# EAGLE design Adafruit PiRTC PCF8523 (EAGLE 6.4)
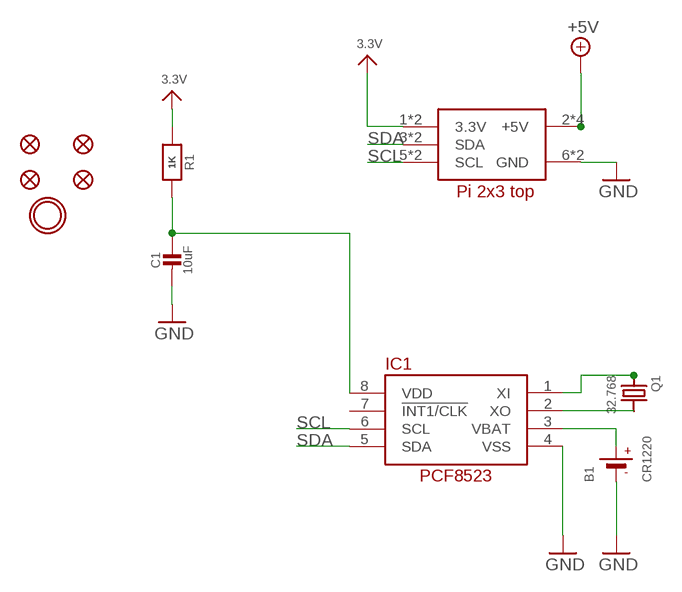
[diagram p0: schematic, sheet 1]

## Parts
B1  CR1220  BATTERYCR1220_SMT  [CR1220]
C1  10uF  CAP_CERAMIC0805-NOOUTLINE  [0805-NO]
FID1  FIDUCIAL_1MM  [FIDUCIAL_1MM]
FID2  FIDUCIAL_1MM  [FIDUCIAL_1MM]
FID3  FIDUCIAL_1MM  [FIDUCIAL_1MM]
FID4  FIDUCIAL_1MM  [FIDUCIAL_1MM]
IC1  RTC_PCF8523T  [SOIC8_150MIL]
Q1  32.768  CRYSTAL8.0X3.8  [CRYSTAL_8X3.8]
R1  1K  RESISTOR0805_NOOUTLINE  [0805-NO]
RPI1  RASPBERRYPI_2X3  [RASPBERRYPI_2X3_THMSMT]
U$4  MOUNTINGHOLE3.0THIN  [MOUNTINGHOLE_3.0_PLATEDTHIN]

## Nets
3.3V: R1.1 RPI1.1'(3.3V) RPI1.1(3.3V)
+5V: RPI1.2'(+5V) RPI1.2(+5V) RPI1.4'(+5V) RPI1.4(+5V)
GND: B1.- C1.2 IC1.4(VSS) RPI1.6'(GND) RPI1.6(GND)
N$14: IC1.1(XI) Q1.P$1
N$15: IC1.2(XO) Q1.P$4
SCL: IC1.6(SCL) RPI1.5'(SCL) RPI1.5(SCL)
SDA: IC1.5(SDA) RPI1.3'(SDA) RPI1.3(SDA)
VBAT: B1.+$1(+) B1.+$2(+) IC1.3(VBAT)
VDD: C1.1 IC1.8(VDD) R1.2
Unconnected: IC1.7(!INT1/CLK)

## Library data of the parts
B1 = microbuilder:BATTERY: CR1220 SMT - Digikey: 3001K-ND CD2032 BAT-HLD-001 - Digikey: BAT-HLD-001-ND
C1 = microbuilder:CAP_CERAMIC: Ceramic Capacitors For new designs, use the packages preceded by an '_' character since they are more reliable: The following footprints should be used on most boards: _0402 - Standard footprint for regular board layouts _0603 - Standard footprint for regular board layouts _0805 - Standard footprint for regular board layouts _1206 - Standard footprint for regular board layouts For extremely tight-pitch boards where space is at a premium, the following 'micro-pitch' footprints can be used (smaller pads, no silkscreen outline, etc.): _0402MP - Micro-pitch footprint for very dense/compact boards _0603MP - Micro-pitch footprint for very dense/compact boards _0805MP - Micro-pitch footprint for very dense/compact boards _1206MP - Micro-pitch footprint for very dense/compact boards
FID1-FID4 = microbuilder:FIDUCIAL: Fiducial Alignment Points Various fiducial points for machine vision alignment.; BOM: EXCLUDE
IC1 = microbuilder:RTC_PCF8523
Q1 = microbuilder:CRYSTAL: Crystals HC49UP - Surface Mount Crystal 4.0MHz 18pF +/-30ppm Surface Mount Crystal [Digikey: 535-9857-1-ND] 12.0 MHz Surface Mount Crystal [Digikey: 535-9869-6-ND] 25.0 MHz Surface Mount Crystal [Digikey: 535-9078-1-ND] 2.5 x 2.0mm - MEMs SMT Crystal 16.0 MHz 10pF 20ppm 2.5 x 2.0mm Crystal [Digikey -40-85°C: 535-10923-1-ND] 3.2 x 2.5mm - MEMs SMT Crystal 12.0 MHz 8pF 15ppm 3.2 x 2.5mm Crystal [Digikey: -10-70°C: 644-1047-1-ND -40-125°C: 644-1128-1-ND] 40~85°C cheaper: 644-1173-6-ND 16.0 MHz 8pF 15ppm 3.2 x 2.5mm Crystal [Digikey: -10-70°C: 644-1049-1-ND -40-125°C: 644-1129-2-ND]-40~85°C cheaper: 644-1175-6-ND 16.0 MHz 10pF 10ppm 3.2 x 2.5mm Crystal [Digikey: 644-1100-1-ND] 27.12 MHz 18pF 30ppm 3.2 x 2.5mm Crystal [Digikey: 887-1424-1-ND] 27.12MHz 10pF 10ppm 3.2 x 2.5mm Crystal [Digikey: 887-1329-1-ND] 4.9 x 1.8mm - MEMs SMT Crystal 32.768 KHz 12.5pF 20ppm 4.9 x 1.8mm Crystal [Digikey: SE2415CT-ND] 8.0 x 3.8mm - Surface Mount Crystal 32.768kHz 12.5pF 20ppm -40°C-85°C [Digikey: 535-9166-2-ND] Cylinder 32.768KHz Cylinder Crystal (2x6mm body) [Ex. Digikey: 300-8341-2-ND]
R1 = microbuilder:RESISTOR: Resistors For new designs, use the packages preceded by an '_' character since they are more reliable: The following footprints should be used on most boards: _0402 - Standard footprint for regular board layouts _0603 - Standard footprint for regular board layouts _0805 - Standard footprint for regular board layouts _1206 - Standard footprint for regular board layouts For extremely tight-pitch boards where space is at a premium, the following 'micro-pitch' footprints can be used (smaller pads, no silkscreen outline, etc.): _0402MP - Micro-pitch footprint for very dense/compact boards _0603MP - Micro-pitch footprint for very dense/compact boards _0805MP - Micro-pitch footprint for very dense/compact boards _1206MP - Micro-pitch footprint for very dense/compact boards
RPI1 = microbuilder:RASPBERRYPI_2X3
U$4 = microbuilder:MOUNTINGHOLE: Mounting Hole For #2 screws (0.086"/2.18mm width, 0.094"/2.4mm hole) use 2.5mm; BOM: EXCLUDE

## Board
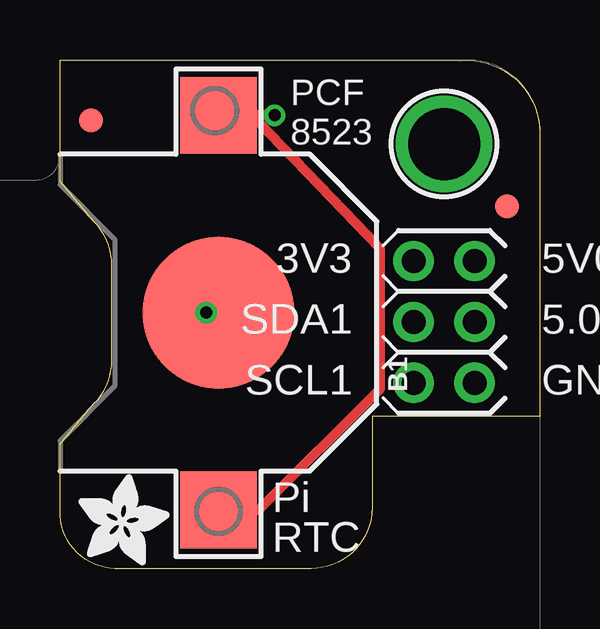
[diagram p1: board, top side]
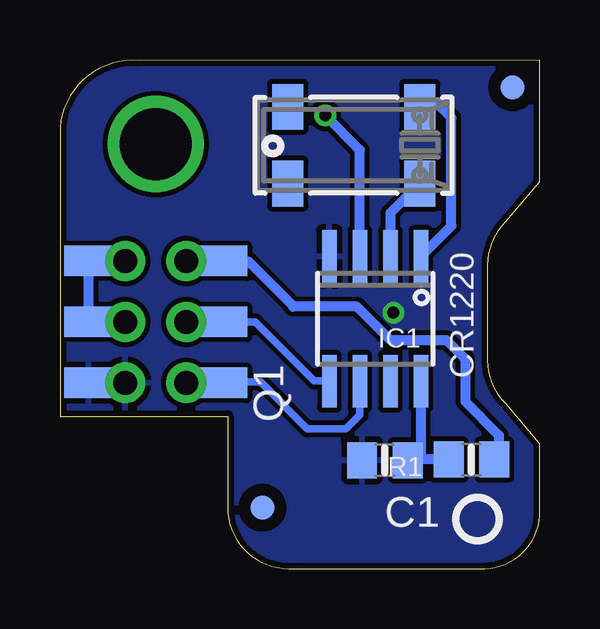
[diagram p2: board, bottom side, seen from below]

Size 19.99 x 21.21 mm. Coordinates in mm from the lower left corner, seen from the top.
Outline: 0,16.13 0,21.21 16.69,21.18 arc-90 19.99,18.39 19.99,6.35 13,6.35 13,2.54 arc-90 10.46,0 2.29,0 arc-90 0,2.41 0,5.21 1.41,6.88 arc45 2.16,8.67 2.16,12.66 arc45 1.41,14.46 0,16.13
Copper layers (1*16): Top 0.035mm / dielectric 1.5mm / Bottom 0.035mm
Design rules "adafruit": minimum track width 8mil, minimum drill 15.5mil, track to track 8mil, track to pad 8mil, pad to pad 8mil, via to via 8mil, smd to smd 8mil, copper to edge 10mil, drill to drill 8mil, minimum pad ring 10mil, minimum via ring 8mil, stop-mask expansion 2mil, vias tented up to drill 20mil, thermal gap 10mil

### Footprints (pad centres in the part's own frame; a part is rotated, then mirrored left to right if it is on the bottom)
CR1220 = smd 3.2 x 3.2: +$1 -8.225,0; +$2 8.225,0 | smd 6.35 x 6.35: - 0,0
0805-NO = smd 1.24 x 1.5: 1 -0.95,0; 2 0.95,0
FIDUCIAL_1MM = smd 1 x 1: 1 0,0
SOIC8_150MIL = smd 0.6 x 2.2: 1 -1.905,-2.6; 2 -0.635,-2.6; 3 0.635,-2.6; 4 1.905,-2.6; 5 1.905,2.6; 6 0.635,2.6; 7 -0.635,2.6; 8 -1.905,2.6
CRYSTAL_8X3.8 = smd 1.3 x 1.9: P$1 -2.75,-1.6; P$2 2.75,-1.6; P$3 2.75,1.6; P$4 -2.75,1.6
RASPBERRYPI_2X3_THMSMT = drill 1 pad 1.676: 1 -1.27,2.54; 2 1.27,2.54; 3 -1.27,0; 4 1.27,0; 5 -1.27,-2.54; 6 1.27,-2.54 | smd 2.032 x 1.27 bottom: 1' -2.794,2.54; 2' 2.794,2.54; 3' -2.794,0; 4' 2.794,0; 5' -2.794,-2.54; 6' 2.794,-2.54
MOUNTINGHOLE_3.0_PLATEDTHIN = drill 3 pad 3.6: P$1 0,0

### Placement (x,y rotation side)
B1  6.6,10.67 90 top
C1  6.45,4.52 180 bottom
FID1  1.3,18.69 180 top
FID2  18.62,15.11 180 top
FID3  11.56,2.54 0 bottom
FID4  1.14,20.07 0 bottom
IC1  6.86,10.41 180 bottom
Q1  7.75,17.65 180 bottom
R1  2.84,4.55 180 bottom
RPI1  16,10.29 0 top
U$2  [ADAFRUIT_3.5MM]  0.76,0.13 0 top
U$3  [PCBFEAT-REV-040]  2.59,2.06 90 bottom
U$4  16,17.7 180 top

### Tracks (layer width: path | path; a pad name or v marks a point on that pad's centre or on a via)
3.3V
  Bottom 0.406: RPI1.1 RPI1.1' 12.12,12.8 10.29,10.97 10.29,10.92 7.62,10.92 6.22,9.52 3.89,9.52 3.1,8.74 3.1,6.96 1.7,5.56 1.7,4.87 1.89,4.87 R1.1
+5V
  Bottom 0.406: RPI1.2 RPI1.2' RPI1.4' RPI1.4
GND  (via drill 0.5)
  Top 0.406: B1.- v6.1,10.67
  Bottom 0.406: RPI1.6' RPI1.6
  pour Bottom: 19.68,-0.03 20.19,21.21 -0.25,21.21 -0.13,-0.03
N$14
  Bottom 0.406: IC1.1 3.68,14.28 3.68,18.8 4.19,19.3 4.95,19.3 Q1.P$1
N$15
  Bottom 0.406: Q1.P$4 6.22,14.83 IC1.2
SCL
  Bottom 0.305: IC1.6 7.49,6.4 8.08,5.82 9.68,5.82 11.63,7.77 13.18,7.77 RPI1.5' RPI1.5
SDA
  Bottom 0.305: IC1.5 9.39,7.81 11.86,10.29 RPI1.3'
  Bottom 0.406: RPI1.3' RPI1.3
VBAT  (via drill 0.5)
  Top 0.406: B1.+$1 8.28,2.44 13.33,7.49 13.33,13.33 7.75,19.18 7.04,19.18 | 7.04,19.18 6.89,19.18 B1.+$2 7.49,18 | v8.94,18.9 7.31,18.9 7.04,19.18
  Bottom 0.406: IC1.3 7.49,17.45 v8.94,18.9
VDD
  Bottom 0.406: R1.2 5.09,4.55 C1.1 4.95,4.56 IC1.8

### Text on the board
tPlace: PCF / 8523 | Pi | RTC
bPlace: CR1220